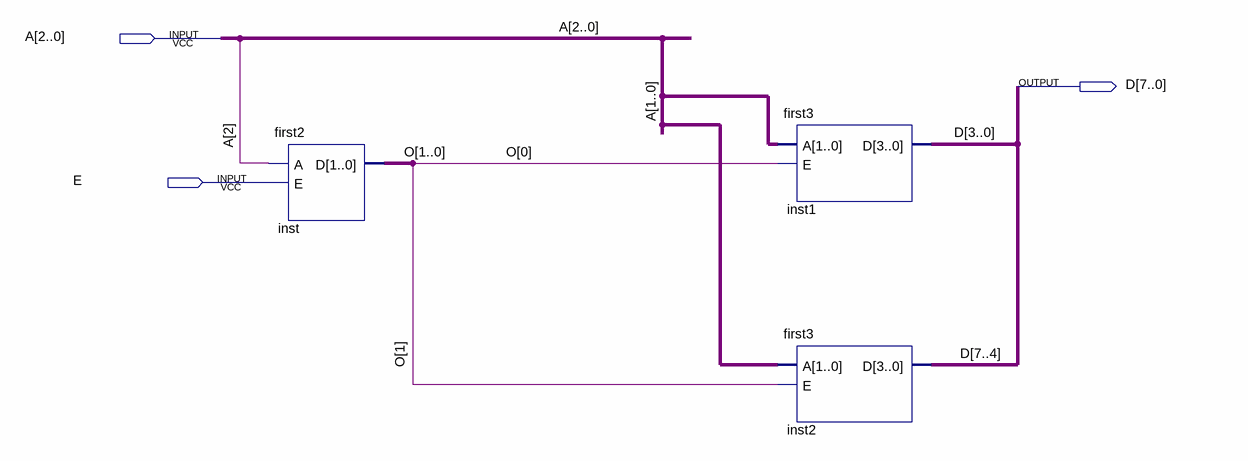
[diagram p0: schematic sheet]
// Quartus schematic first5.bdf as structural Verilog: 3 symbols, 3 pins
module first5 (
  input  [2:0] A,
  input  E,
  output [7:0] D
);

  wire [1:0] O;

  first2 inst (.A(A[2]), .E(E), .D(O));
  first3 inst1 (.A(A), .E(O[0]), .D(D[3:0]));
  first3 inst2 (.A(A[1:0]), .E(O[1]), .D(D[7:4]));
endmodule
